# Altium schematic sheet Sheet4.SchDoc
size A4; SheetNumber: 1; SheetTotal: 5
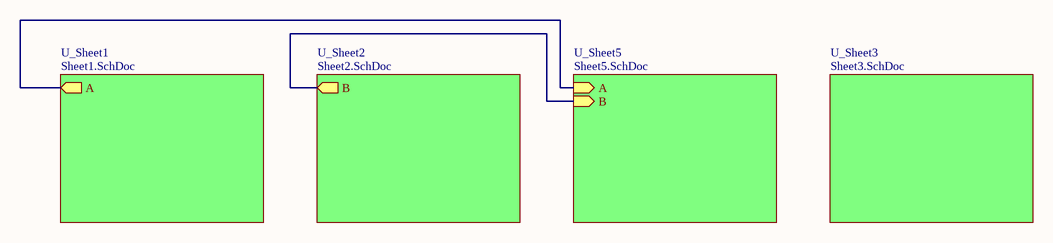
[diagram p0: Sheet4.SchDoc]

## Sub-sheets
U_Sheet1 = Sheet1.SchDoc: A (out)
U_Sheet2 = Sheet2.SchDoc: B (out)
U_Sheet3 = Sheet3.SchDoc: no entries
U_Sheet5 = Sheet5.SchDoc: A (in), B (in)

## Nets
(unnamed): sheet U_Sheet1/A, sheet U_Sheet5/A
(unnamed): sheet U_Sheet2/B, sheet U_Sheet5/B